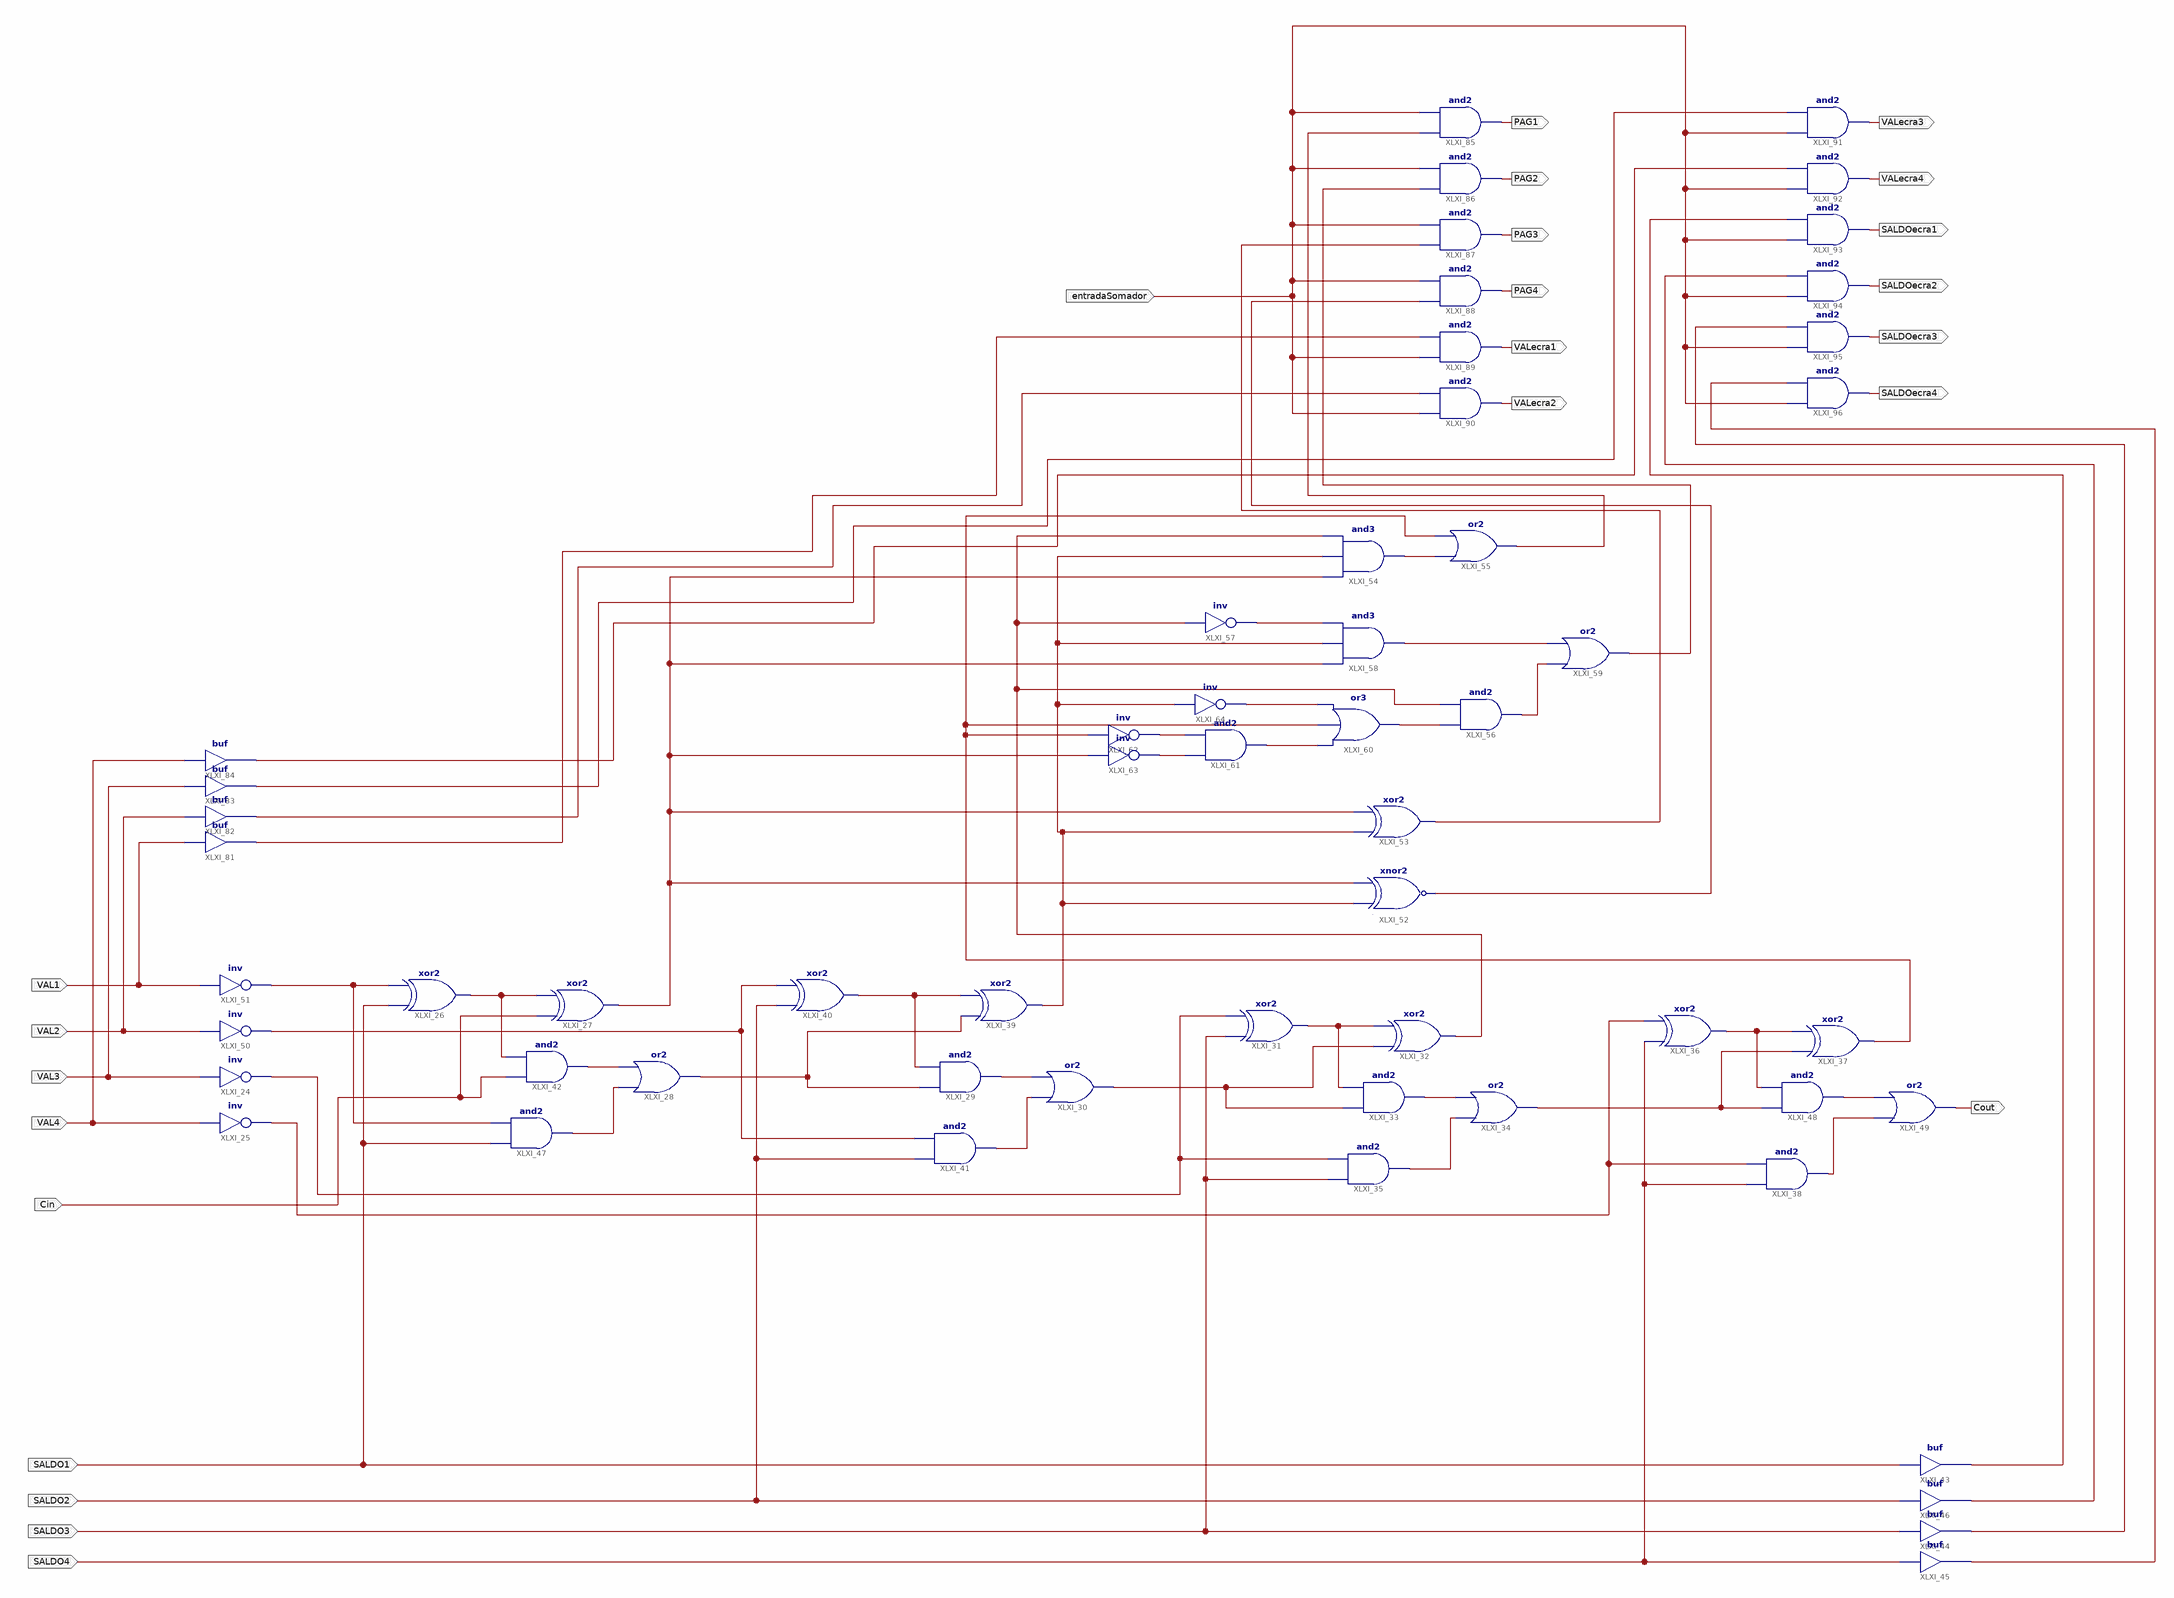
[diagram p0: schematic sheet 1]
// Xilinx ISE schematic Somador.sch (spartan3e) as structural Verilog: 57 symbols, 23 ports
module Somador (
  input  VAL1,
  input  VAL2,
  input  VAL3,
  input  VAL4,
  input  SALDO2,
  input  SALDO4,
  input  SALDO3,
  input  Cin,
  input  SALDO1,
  input  entradaSomador,
  output Cout,
  output SALDOecra4,
  output SALDOecra3,
  output SALDOecra2,
  output SALDOecra1,
  output VALecra1,
  output VALecra2,
  output VALecra3,
  output VALecra4,
  output PAG1,
  output PAG2,
  output PAG3,
  output PAG4
);

  wire Saldoe1, Saldoe2, Saldoe3, Saldoe4, SOMA1, SOMA2, SOMA3, SOMA4, SOMAE1, SOMAE2, SOMAE3, SOMAE4,
       XLXN_52, XLXN_54, XLXN_55, XLXN_56, XLXN_58, XLXN_59, XLXN_60, XLXN_62, XLXN_63, XLXN_64, XLXN_66,
       XLXN_68, XLXN_85, XLXN_88, XLXN_94, XLXN_96, XLXN_98, XLXN_99, XLXN_100, XLXN_103, XLXN_151, XLXN_152,
       XLXN_153, XLXN_155, XLXN_156, XLXN_157, XLXN_158, XLXN_159, XLXN_175, XLXN_177, XLXN_181, XLXN_182;

  not XLXI_24 (XLXN_96, VAL3);
  not XLXI_25 (XLXN_98, VAL4);
  xor XLXI_26 (XLXN_85, SALDO1, XLXN_99);
  xor XLXI_27 (SOMA4, Cin, XLXN_85);
  or XLXI_28 (XLXN_64, XLXN_54, XLXN_52);
  and XLXI_29 (XLXN_55, XLXN_64, XLXN_56);
  or XLXI_30 (XLXN_66, XLXN_58, XLXN_55);
  xor XLXI_31 (XLXN_60, SALDO3, XLXN_96);
  xor XLXI_32 (SOMA2, XLXN_66, XLXN_60);
  and XLXI_33 (XLXN_59, XLXN_66, XLXN_60);
  or XLXI_34 (XLXN_68, XLXN_62, XLXN_59);
  and XLXI_35 (XLXN_62, SALDO3, XLXN_96);
  xor XLXI_36 (XLXN_100, SALDO4, XLXN_98);
  xor XLXI_37 (SOMA1, XLXN_68, XLXN_100);
  and XLXI_38 (XLXN_88, SALDO4, XLXN_98);
  xor XLXI_39 (SOMA3, XLXN_64, XLXN_56);
  xor XLXI_40 (XLXN_56, SALDO2, XLXN_94);
  and XLXI_41 (XLXN_58, SALDO2, XLXN_94);
  and XLXI_42 (XLXN_52, Cin, XLXN_85);
  buf XLXI_43 (Saldoe1, SALDO1);
  buf XLXI_44 (Saldoe3, SALDO3);
  buf XLXI_45 (Saldoe4, SALDO4);
  buf XLXI_46 (Saldoe2, SALDO2);
  and XLXI_47 (XLXN_54, SALDO1, XLXN_99);
  and XLXI_48 (XLXN_63, XLXN_68, XLXN_100);
  or XLXI_49 (Cout, XLXN_88, XLXN_63);
  not XLXI_50 (XLXN_94, VAL2);
  not XLXI_51 (XLXN_99, VAL1);
  xnor XLXI_52 (SOMAE4, SOMA3, SOMA4);
  xor XLXI_53 (SOMAE3, SOMA3, SOMA4);
  and XLXI_54 (XLXN_103, SOMA4, SOMA3, SOMA2);
  or XLXI_55 (SOMAE1, XLXN_103, SOMA1);
  and XLXI_56 (XLXN_156, XLXN_153, SOMA2);
  not XLXI_57 (XLXN_151, SOMA2);
  and XLXI_58 (XLXN_152, SOMA4, SOMA3, XLXN_151);
  or XLXI_59 (SOMAE2, XLXN_156, XLXN_152);
  or XLXI_60 (XLXN_153, XLXN_155, SOMA1, XLXN_159);
  and XLXI_61 (XLXN_155, XLXN_158, XLXN_157);
  not XLXI_62 (XLXN_157, SOMA1);
  not XLXI_63 (XLXN_158, SOMA4);
  not XLXI_64 (XLXN_159, SOMA3);
  buf XLXI_81 (XLXN_175, VAL1);
  buf XLXI_82 (XLXN_177, VAL2);
  buf XLXI_83 (XLXN_181, VAL3);
  buf XLXI_84 (XLXN_182, VAL4);
  and XLXI_85 (PAG1, SOMAE1, entradaSomador);
  and XLXI_86 (PAG2, SOMAE2, entradaSomador);
  and XLXI_87 (PAG3, SOMAE3, entradaSomador);
  and XLXI_88 (PAG4, SOMAE4, entradaSomador);
  and XLXI_89 (VALecra1, entradaSomador, XLXN_175);
  and XLXI_90 (VALecra2, entradaSomador, XLXN_177);
  and XLXI_91 (VALecra3, entradaSomador, XLXN_181);
  and XLXI_92 (VALecra4, entradaSomador, XLXN_182);
  and XLXI_93 (SALDOecra1, entradaSomador, Saldoe1);
  and XLXI_94 (SALDOecra2, entradaSomador, Saldoe2);
  and XLXI_95 (SALDOecra3, entradaSomador, Saldoe3);
  and XLXI_96 (SALDOecra4, entradaSomador, Saldoe4);
endmodule
